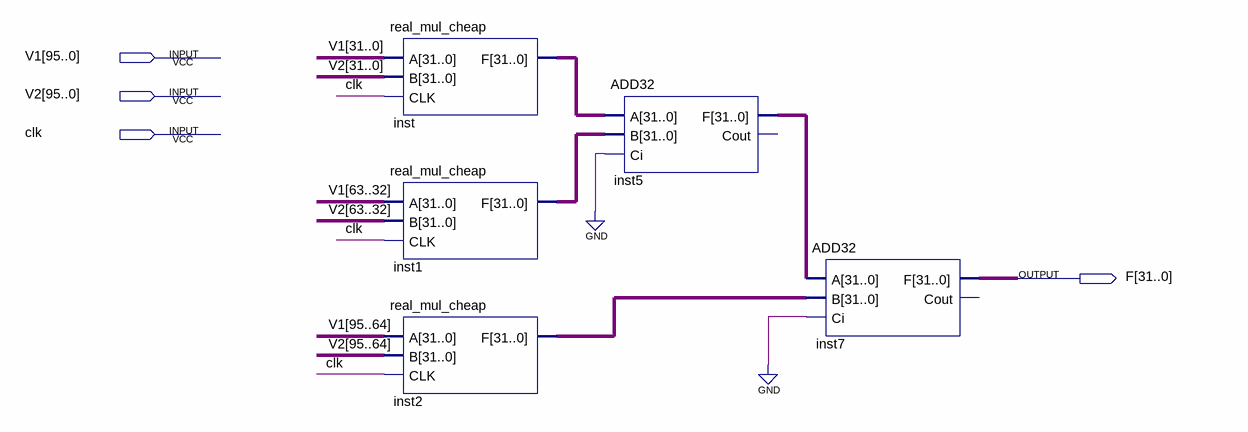
[diagram p0: schematic sheet]
// Quartus schematic vec3_dot_cheap.bdf as structural Verilog: 5 symbols, 4 pins
module vec3_dot_cheap (
  input  [95:0] V1,
  input  [95:0] V2,
  input  clk,
  output [31:0] F
);

  wire [31:0] inst1_f, inst2_f, inst5_f, inst_f;

  real_mul_cheap inst (.A(V1[31:0]), .B(V2[31:0]), .CLK(clk), .F(inst_f));
  real_mul_cheap inst1 (.A(V1[63:32]), .B(V2[63:32]), .CLK(clk), .F(inst1_f));
  real_mul_cheap inst2 (.A(V1[95:64]), .B(V2[95:64]), .CLK(clk), .F(inst2_f));
  ADD32 inst5 (.A(inst_f), .B(inst1_f), .Ci(1'b0), .F(inst5_f));  // open: Cout
  ADD32 inst7 (.A(inst5_f), .B(inst2_f), .Ci(1'b0), .F(F));  // open: Cout
endmodule
